# EAGLE design ArduinoPCB (EAGLE 9.6.2)
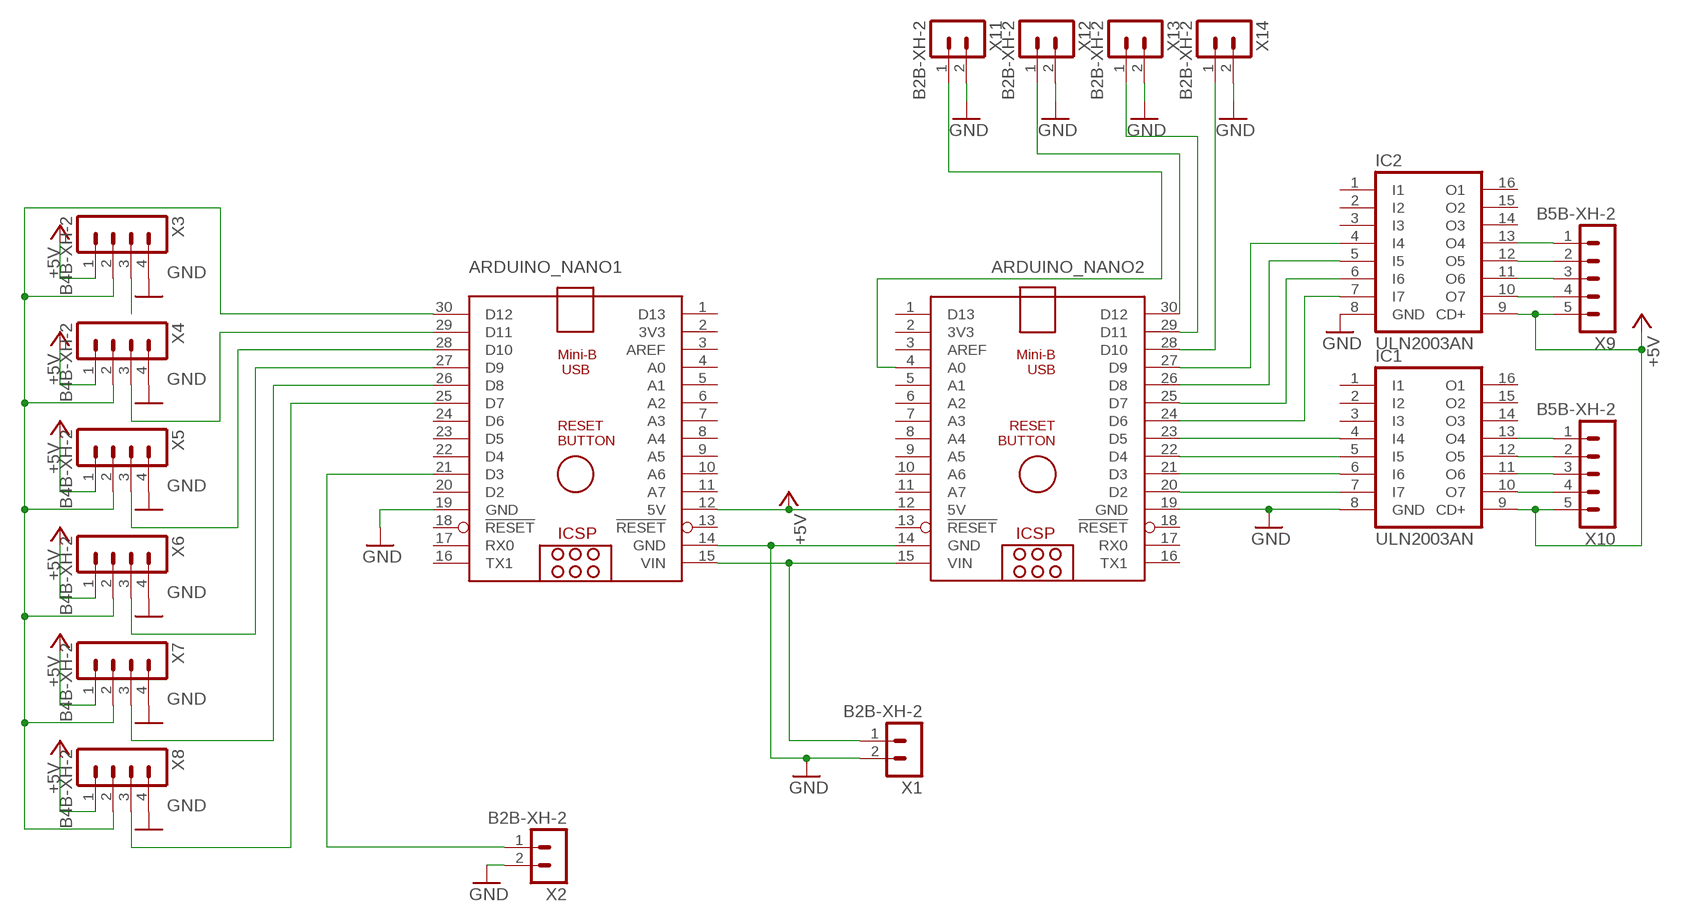
[diagram p0: schematic, sheet 1]

## Parts
ARDUINO_NANO1  ARDUINO_NANO  [ARDUINO_NANO]
ARDUINO_NANO2  ARDUINO_NANO  [ARDUINO_NANO]
IC1  ULN2003AN  [DIL16]
IC2  ULN2003AN  [DIL16]
X1  B2B-XH-2  [B2B-XH-A]
X2  B2B-XH-2  [B2B-XH-A]
X3  B4B-XH-2  [B4B-XH-A]
X4  B4B-XH-2  [B4B-XH-A]
X5  B4B-XH-2  [B4B-XH-A]
X6  B4B-XH-2  [B4B-XH-A]
X7  B4B-XH-2  [B4B-XH-A]
X8  B4B-XH-2  [B4B-XH-A]
X9  B5B-XH-2  [B5B-XH-A]
X10  B5B-XH-2  [B5B-XH-A]
X11  B2B-XH-2  [B2B-XH-A]
X12  B2B-XH-2  [B2B-XH-A]
X13  B2B-XH-2  [B2B-XH-A]
X14  B2B-XH-2  [B2B-XH-A]

## Nets
+5V: ARDUINO_NANO1.12(5V) ARDUINO_NANO2.12(5V) IC1.9(CD+) IC2.9(CD+) X3.1 X4.1 X5.1 X6.1 X7.1 X8.1 X9.5 X10.5
GND: ARDUINO_NANO1.14(GND) ARDUINO_NANO1.19(GND) ARDUINO_NANO2.14(GND) ARDUINO_NANO2.19(GND) IC1.8(GND) IC2.8(GND) X1.2 X2.2 X3.4 X4.4 X5.4 X6.4 X7.4 X8.4 X11.2 X12.2 X13.2 X14.2
N$1: ARDUINO_NANO2.29(D11) X13.1
N$2: IC1.10(O7) X10.4
N$3: IC1.11(O6) X10.3
N$4: IC1.12(O5) X10.2
N$5: IC1.13(O4) X10.1
N$6: IC2.10(O7) X9.4
N$7: IC2.11(O6) X9.3
N$8: IC2.12(O5) X9.2
N$9: IC2.13(O4) X9.1
N$10: ARDUINO_NANO2.20(D2) IC1.7(I7)
N$11: ARDUINO_NANO2.21(D3) IC1.6(I6)
N$12: ARDUINO_NANO2.22(D4) IC1.5(I5)
N$13: ARDUINO_NANO2.23(D5) IC1.4(I4)
N$14: ARDUINO_NANO2.27(D9) IC2.4(I4)
N$15: ARDUINO_NANO2.26(D8) IC2.5(I5)
N$16: ARDUINO_NANO2.25(D7) IC2.6(I6)
N$17: ARDUINO_NANO2.24(D6) IC2.7(I7)
N$18: ARDUINO_NANO2.30(D12) X12.1
N$19: ARDUINO_NANO2.4(A0) X11.1
N$20: ARDUINO_NANO1.15(VIN) ARDUINO_NANO2.15(VIN) X1.1
N$22: ARDUINO_NANO1.21(D3) X2.1
N$24: ARDUINO_NANO1.26(D8) X7.3
N$25: X3.3
N$26: ARDUINO_NANO2.28(D10) X14.1
N$27: ARDUINO_NANO1.29(D11) X4.3
N$28: ARDUINO_NANO1.28(D10) X5.3
N$31: ARDUINO_NANO1.27(D9) X6.3
N$34: ARDUINO_NANO1.30(D12) X3.2 X4.2 X5.2 X6.2 X7.2 X8.2
N$35: ARDUINO_NANO1.25(D7) X8.3
Unconnected: ARDUINO_NANO1.1(D13) ARDUINO_NANO1.2(3V3) ARDUINO_NANO1.3(AREF) ARDUINO_NANO1.4(A0) ARDUINO_NANO1.5(A1) ARDUINO_NANO1.6(A2) ARDUINO_NANO1.7(A3) ARDUINO_NANO1.8(A4) ARDUINO_NANO1.9(A5) ARDUINO_NANO1.10(A6) ARDUINO_NANO1.11(A7) ARDUINO_NANO1.13(!RESET) ARDUINO_NANO1.16(TX1) ARDUINO_NANO1.17(RX0) ARDUINO_NANO1.18(!RESET) ARDUINO_NANO1.20(D2) ARDUINO_NANO1.22(D4) ARDUINO_NANO1.23(D5) ARDUINO_NANO1.24(D6) ARDUINO_NANO2.1(D13) ARDUINO_NANO2.2(3V3) ARDUINO_NANO2.3(AREF) ARDUINO_NANO2.5(A1) ARDUINO_NANO2.6(A2) ARDUINO_NANO2.7(A3) ARDUINO_NANO2.8(A4) ARDUINO_NANO2.9(A5) ARDUINO_NANO2.10(A6) ARDUINO_NANO2.11(A7) ARDUINO_NANO2.13(!RESET) ARDUINO_NANO2.16(TX1) ARDUINO_NANO2.17(RX0) ARDUINO_NANO2.18(!RESET) IC1.1(I1) IC1.2(I2) IC1.3(I3) IC1.14(O3) IC1.15(O2) IC1.16(O1) IC2.1(I1) IC2.2(I2) IC2.3(I3) IC2.14(O3) IC2.15(O2) IC2.16(O1)

## Library data of the parts
ARDUINO_NANO1 ARDUINO_NANO2 = ArduinoNanoV31:ARDUINO_NANO: Arduino Nano V3.0 Overview: The Arduino Nano is a small, complete, and breadboard-friendly board based on the ATmega328 (Arduino Nano 3.x) or ATmega168 (Arduino Nano 2.x). It has more or less the same functionality of the Arduino Duemilanove, but in a different package. It lacks only a DC power jack, and works with a Mini-B USB cable instead of a standard one. The Nano was designed and is being produced by Gravitech. Specifications: Microcontroller Atmel ATmega168 or ATmega328 Operating Voltage (logic level) 5 V Input Voltage (recommended) 7-12 V Input Voltage (limits) 6-20 V Digital I/O Pins 14 (of which 6 provide PWM output) Analog Input Pins 8 DC Current per I/O Pin 40 mA Flash Memory 16 KB (ATmega168) or 32 KB (ATmega328) of which 2 KB used by bootloader SRAM 1 KB (ATmega168) or 2 KB (ATmega328) EEPROM 512 bytes (ATmega168) or 1 KB (ATmega328) Clock Speed 16 MHz Dimensions 0.73" x 1.70" Length 45 mm Width 18 mm Weigth 5 g Power: The Arduino Nano can be powered via the Mini-B USB connection, 6-20V unregulated external power supply (pin 30), or 5V regulated external power supply (pin 27). The power source is automatically selected to the highest voltage source. Memory: The ATmega168 has 16 KB of flash memory for storing code (of which 2 KB is used for the bootloader); the ATmega328 has 32 KB, (also with 2 KB used for the bootloader). The ATmega168 has 1 KB of SRAM and 512 bytes of EEPROM (which can be read and written with the EEPROM library); the ATmega328 has 2 KB of SRAM and 1 KB of EEPROM. Input and Output: Each of the 14 digital pins on the Nano can be used as an input or output, using pinMode(), digitalWrite(), and digitalRead() functions. They operate at 5 volts. Each pin can provide or receive a maximum of 40 mA and has an internal pull-up resistor (disconnected by default) of 20-50 kOhms. In addition, some pins have specialized functions. Visit Arduino - ArduinoBoardNano <https://www.arduino.cc/en/Main/ArduinoBoardNano>
IC1 IC2 = uln-udn:ULN2003A: DRIVER ARRAY
X1 X2 X11-X14 = con-JST XH:B2B-XH: JST XH series header 2.50mm pitch disconnectable crimp style connectors, vertical (side entry type), 2 pins
X3-X8 = con-JST XH:B4B-XH: JST XH series header 2.50mm pitch disconnectable crimp style connectors, vertical (side entry type), 4 pins
X9 X10 = con-JST XH:B5B-XH: JST XH series header 2.50mm pitch disconnectable crimp style connectors, vertical (side entry type), 5 pins

## Board
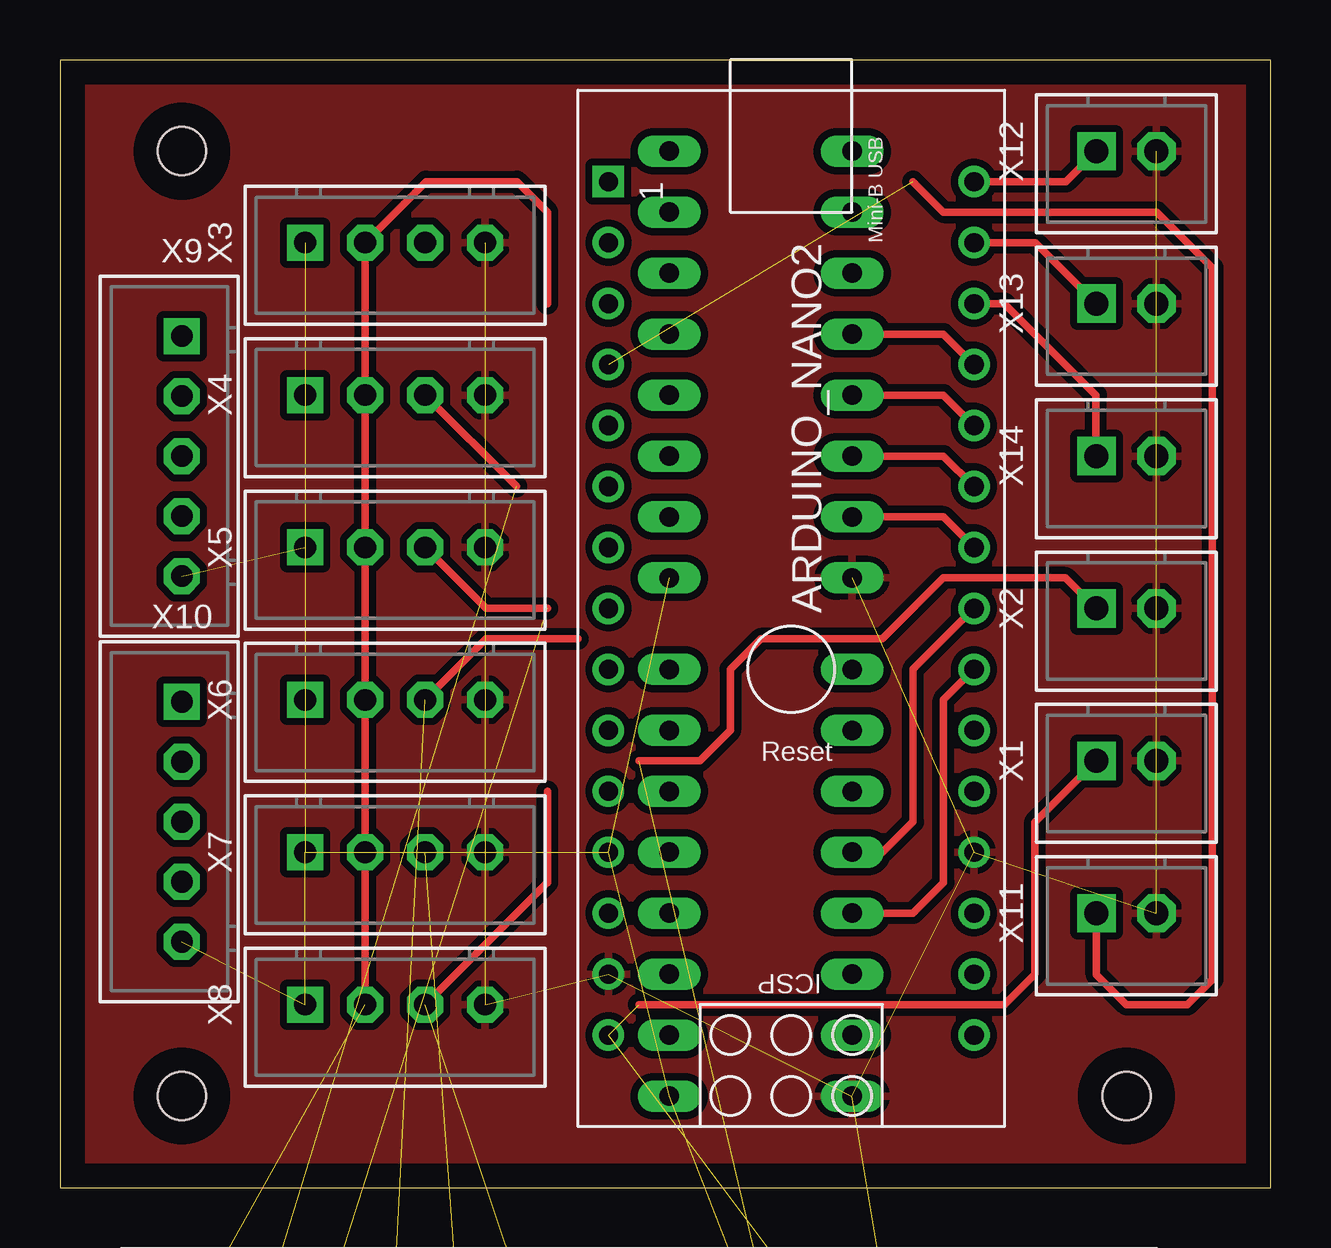
[diagram p1: board, top side]
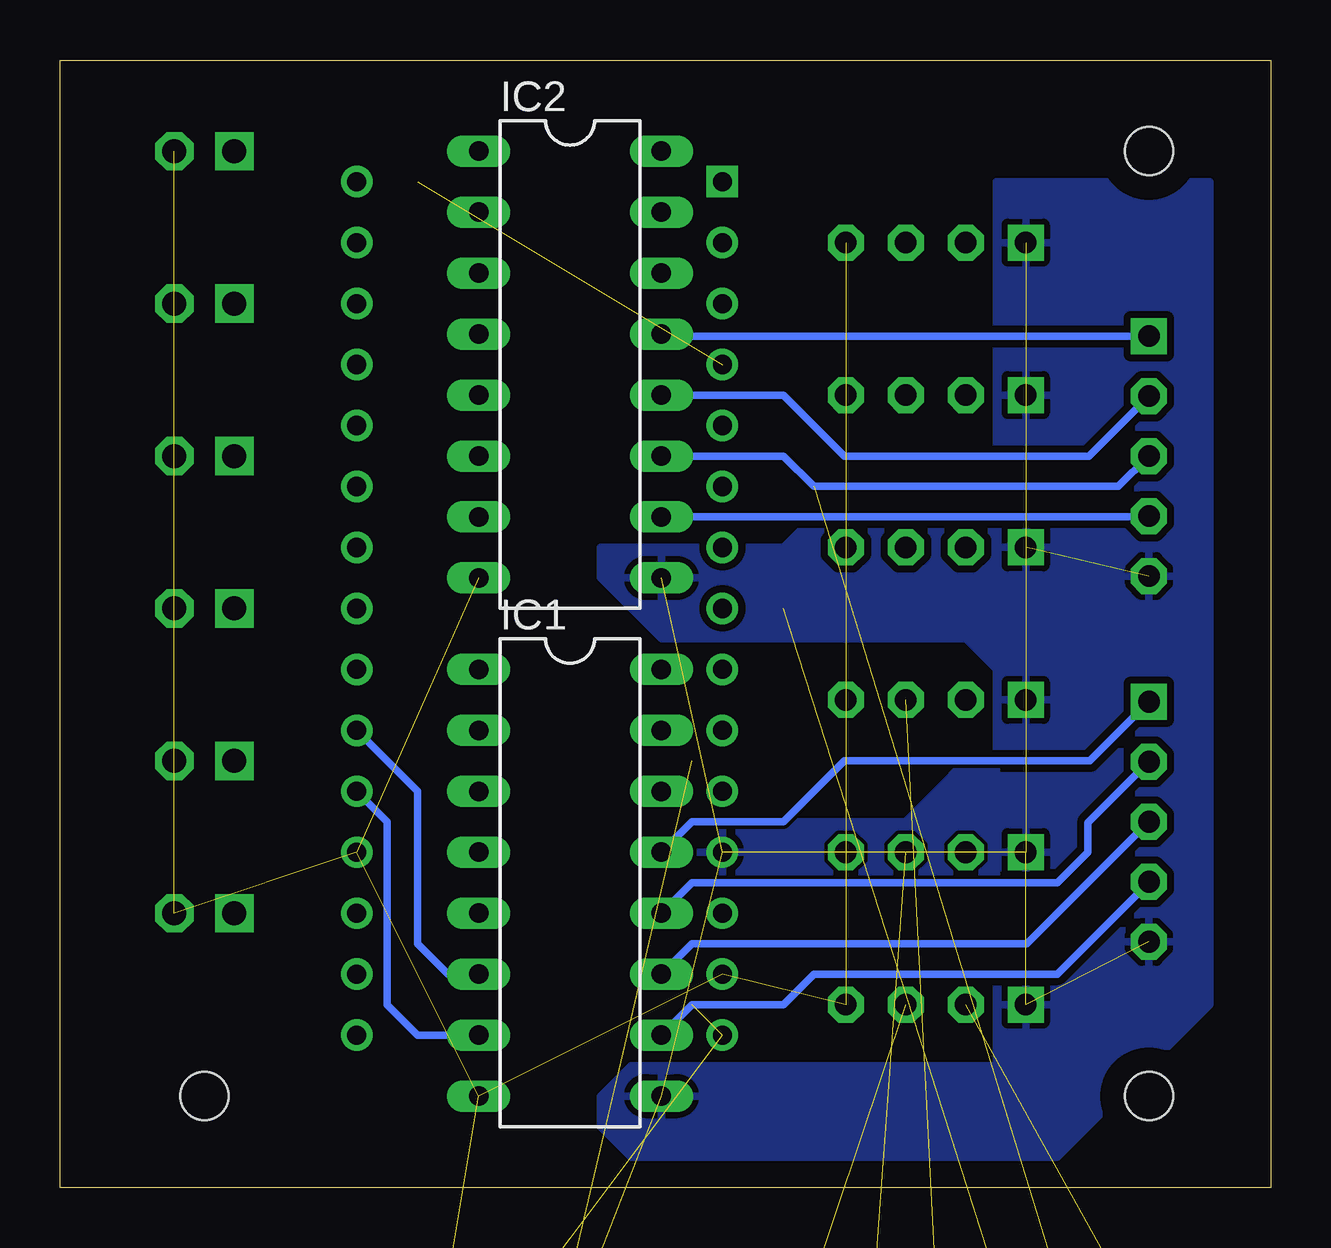
[diagram p2: board, bottom side, seen from below]

Size 50.47 x 46.98 mm. Coordinates in mm from the lower left corner, seen from the top.
Outline: 0,0 50.47,0 50.47,46.98 0,46.98 0,0
Copper layers (1*16): Top 0.035mm / dielectric 1.5mm / Bottom 0.035mm
Design rules "default": minimum track width 6mil, minimum drill 0.35mm, track to track 6mil, track to pad 6mil, pad to pad 6mil, via to via 6mil, smd to smd 6mil, copper to edge 40mil, drill to drill 6mil, minimum pad ring 10mil, minimum via ring 8mil, stop-mask expansion 4mil, vias tented up to drill 0mil, thermal gap 10mil
Holes 2 mm at 5.08,43.18 44.45,3.81 5.08,3.81

### Footprints (pad centres in the part's own frame; a part is rotated, then mirrored left to right if it is on the bottom)
ARDUINO_NANO = drill 0.8 square: 1 -20.32,-7.62 | drill 0.8: 2 -17.78,-7.62; 3 -15.24,-7.62; 4 -12.7,-7.62; 5 -10.16,-7.62; 6 -7.62,-7.62; 7 -5.08,-7.62; 8 -2.54,-7.62; 9 0,-7.62; 10 2.54,-7.62; 11 5.08,-7.62; 12 7.62,-7.62; 13 10.16,-7.62; 14 12.7,-7.62; 15 15.24,-7.62; 16 15.24,7.62; 17 12.7,7.62; 18 10.16,7.62; 19 7.62,7.62; 20 5.08,7.62; 21 2.54,7.62; 22 0,7.62; 23 -2.54,7.62; 24 -5.08,7.62; 25 -7.62,7.62; 26 -10.16,7.62; 27 -12.7,7.62; 28 -15.24,7.62; 29 -17.78,7.62; 30 -20.32,7.62
DIL16 = drill 0.813 long: 1 -8.89,-3.81; 2 -6.35,-3.81; 3 -3.81,-3.81; 4 -1.27,-3.81; 5 1.27,-3.81; 6 3.81,-3.81; 7 6.35,-3.81; 8 8.89,-3.81; 9 8.89,3.81; 10 6.35,3.81; 11 3.81,3.81; 12 1.27,3.81; 13 -1.27,3.81; 14 -3.81,3.81; 15 -6.35,3.81; 16 -8.89,3.81
B2B-XH-A = drill 1 pad 1.6 square: 1 1.25,0 | drill 1 pad 1.6 octagon: 2 -1.25,0
B4B-XH-A = drill 0.9 pad 1.5 square: 1 3.75,0 | drill 0.9 pad 1.5 octagon: 2 1.25,0; 3 -1.25,0; 4 -3.75,0
B5B-XH-A = drill 0.9 pad 1.5 square: 1 5,0 | drill 0.9 pad 1.5 octagon: 2 2.5,0; 3 0,0; 4 -2.5,0; 5 -5,0

### Placement (x,y rotation side)
ARDUINO_NANO1  26.67,-11.43 0 top  (outside the outline)
ARDUINO_NANO2  30.48,21.59 270 top
IC1  29.21,12.7 270 bottom
IC2  29.21,34.29 270 bottom
X1  44.45,17.78 180 top
X2  44.45,24.13 180 top
X3  13.97,39.37 180 top
X4  13.97,33.02 180 top
X5  13.97,26.67 180 top
X6  13.97,20.32 180 top
X7  13.97,13.97 180 top
X8  13.97,7.62 180 top
X9  5.08,30.48 90 top
X10  5.08,15.24 90 top
X11  44.45,11.43 180 top
X12  44.45,43.18 180 top
X13  44.45,36.83 180 top
X14  44.45,30.48 180 top

### Tracks (layer width: path | path; a pad name or v marks a point on that pad's centre or on a via)
+5V  (11 unrouted)
  pour Bottom (isolate 0.305): 2.54,41.91 2.54,7.62 6.35,3.81 10.16,3.81 11.43,5.08 11.43,21.59 12.7,22.86 25.4,22.86 27.94,25.4 27.94,26.67 20.32,26.67 17.78,29.21 11.43,29.21 11.43,41.91
  pour Bottom: 11.43,19.05 15.24,15.24 22.86,15.24 24.13,13.97 24.13,12.7 22.86,11.43 11.43,11.43 11.43,15.24
  pour Bottom: 6.35,3.81 8.89,1.27 26.67,1.27 27.94,2.54 27.94,3.81 26.67,5.08 25.4,5.08 11.43,5.08 7.62,5.08
GND  (17 unrouted)
  pour Top (isolate 0.305): 0,46.99 0,0 50.8,0 50.8,46.99
N$1
  Top 0.305: X13.1 40.66,39.37 ARDUINO_NANO2.29
N$2
  Bottom 0.305: IC1.10 24.13,7.62 20.32,7.62 19.05,8.89 8.89,8.89 5.08,12.7 X10.4
N$3
  Bottom 0.305: IC1.11 24.13,10.16 10.16,10.16 X10.3
N$4
  Bottom 0.305: IC1.12 24.13,12.7 8.89,12.7 7.62,13.97 7.62,15.2 X10.2
N$5
  Bottom 0.305: IC1.13 24.13,15.24 20.32,15.24 17.78,17.78 7.54,17.78 X10.1
N$6
  Bottom 0.305: IC2.10 5.12,27.94 X9.4
N$7
  Bottom 0.305: IC2.11 20.32,30.48 19.05,29.21 6.35,29.21 X9.3
N$8
  Bottom 0.305: IC2.12 20.32,33.02 17.78,30.48 7.58,30.48 X9.2
N$9
  Bottom 0.305: IC2.13 25.32,35.48 X9.1
N$10
  Bottom 0.305: IC1.7 35.56,6.35 36.83,7.62 36.83,15.24 ARDUINO_NANO2.20
N$11
  Bottom 0.305: IC1.6 34.29,8.89 35.56,10.16 35.56,16.51 ARDUINO_NANO2.21
N$12
  Top 0.305: IC1.5 35.56,11.43 36.83,12.7 36.83,20.32 ARDUINO_NANO2.22
N$13
  Top 0.305: IC1.4 34.29,13.97 35.56,15.24 35.56,21.59 ARDUINO_NANO2.23
N$14
  Top 0.305: IC2.4 36.83,35.56 ARDUINO_NANO2.27
N$15
  Top 0.305: IC2.5 36.83,33.02 ARDUINO_NANO2.26
N$16
  Top 0.305: IC2.6 36.83,30.48 ARDUINO_NANO2.25
N$17
  Top 0.305: IC2.7 36.83,27.94 ARDUINO_NANO2.24
N$18
  Top 0.305: X12.1 41.93,41.91 ARDUINO_NANO2.30
N$19  (1 unrouted)
  Top 0.305: 35.56,41.91 36.83,40.64 45.72,40.64 48.03,38.33 48.03,8.66 46.99,7.62 44.45,7.62 43.2,8.87 X11.1
N$20  (2 unrouted)
  Top 0.305: X1.1 40.64,15.22 40.64,8.89 39.37,7.62 24.13,7.62
N$22  (1 unrouted)
  Top 0.305: X2.1 43.18,24.13 41.91,25.4 36.83,25.4 34.29,22.86 29.21,22.86 27.94,21.59 27.94,19.05 26.67,17.78 24.13,17.78
N$24  (1 unrouted)
  Top 0.305: 15.24,13.97 X7.3
N$25
  Top 0.305: 15.24,39.37 X3.3
N$26
  Top 0.305: X14.1 43.18,30.5 43.18,33.02 39.37,36.83 ARDUINO_NANO2.28
N$27  (1 unrouted)
  Top 0.305: 19.03,29.21 X4.3
N$28  (1 unrouted)
  Top 0.305: 20.32,24.13 17.76,24.13 X5.3
N$31  (1 unrouted)
  Top 0.305: X6.3 17.76,22.86 21.59,22.86
N$34  (1 unrouted)
  Top 0.305: 12.7,7.64 X8.2 | X8.2 | X4.2 X3.2 15.26,41.91 19.05,41.91 20.32,40.64 20.32,36.83 | X4.2 X6.2 | X6.2 X5.2 X4.2 | X6.2 X7.2 12.72,7.64 X8.2
N$35  (1 unrouted)
  Top 0.305: X8.3 20.3,12.7 20.32,12.7 20.32,16.51